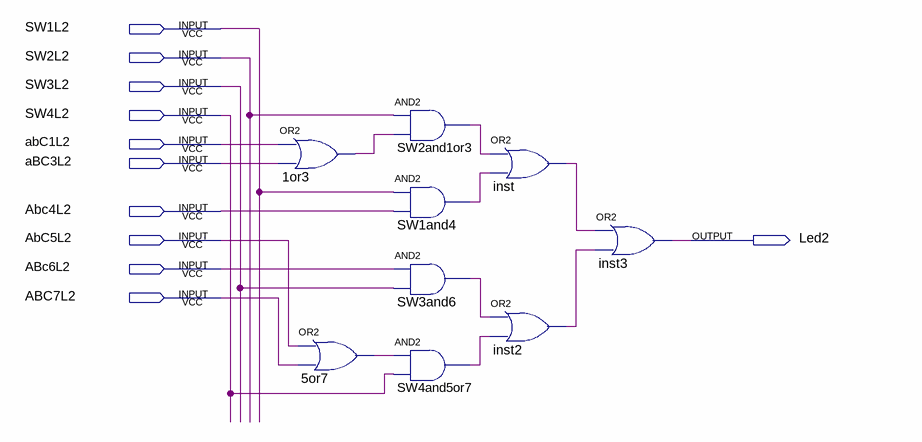
[diagram p0: schematic sheet]
// Quartus schematic Led2.bdf as structural Verilog: 9 symbols, 11 pins
module Led2 (
  input  SW1L2,
  input  SW2L2,
  input  SW3L2,
  input  SW4L2,
  input  abC1L2,
  input  aBC3L2,
  input  Abc4L2,
  input  AbC5L2,
  input  ABc6L2,
  input  ABC7L2,
  output Led2
);

  wire inst2_out, inst_out, n1or3_out, n5or7_out, SW1and4_out, SW2and1or3_out, SW3and6_out, SW4and5or7_out;

  or u_1or3 (n1or3_out, abC1L2, aBC3L2);
  or u_5or7 (n5or7_out, AbC5L2, ABC7L2);
  and SW2and1or3 (SW2and1or3_out, SW2L2, n1or3_out);
  and SW1and4 (SW1and4_out, SW1L2, Abc4L2);
  and SW3and6 (SW3and6_out, ABc6L2, SW3L2);
  and SW4and5or7 (SW4and5or7_out, n5or7_out, SW4L2);
  or inst (inst_out, SW2and1or3_out, SW1and4_out);
  or inst2 (inst2_out, SW3and6_out, SW4and5or7_out);
  or inst3 (Led2, inst_out, inst2_out);
endmodule
